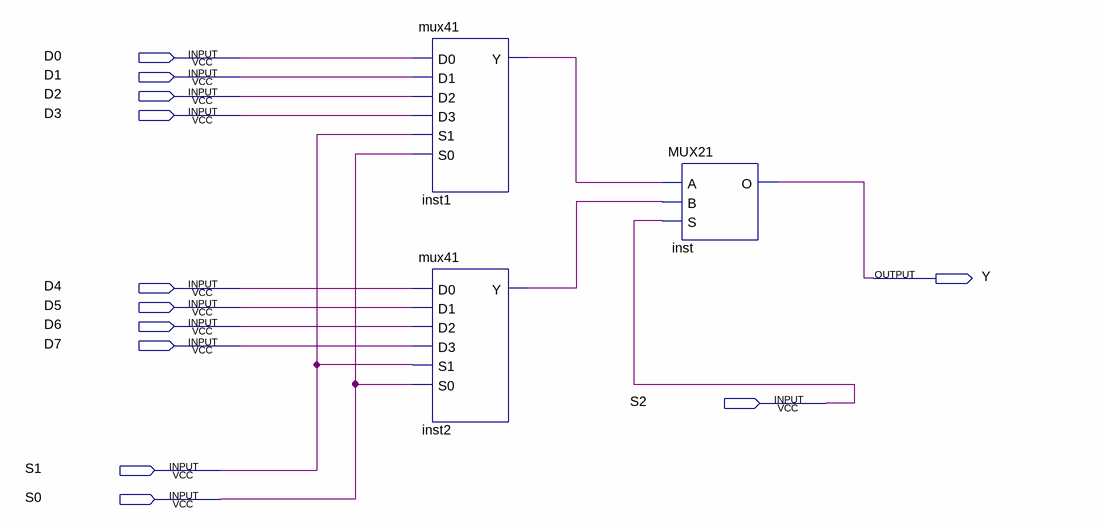
[diagram p0: schematic sheet]
// Quartus schematic mux81.bdf as structural Verilog: 3 symbols, 12 pins
module mux81 (
  input  D0,
  input  D1,
  input  D2,
  input  D3,
  input  D4,
  input  D5,
  input  D6,
  input  D7,
  input  S2,
  input  S1,
  input  S0,
  output Y
);

  wire inst1_y, inst2_y;

  mux41 inst1 (.D0(D0), .D1(D1), .D2(D2), .D3(D3), .S1(S1), .S0(S0), .Y(inst1_y));
  mux41 inst2 (.D0(D4), .D1(D5), .D2(D6), .D3(D7), .S1(S1), .S0(S0), .Y(inst2_y));
  MUX21 inst (.A(inst1_y), .S(S2), .B(inst2_y), .O(Y));
endmodule
